# Altium project sensor.PrjPcb
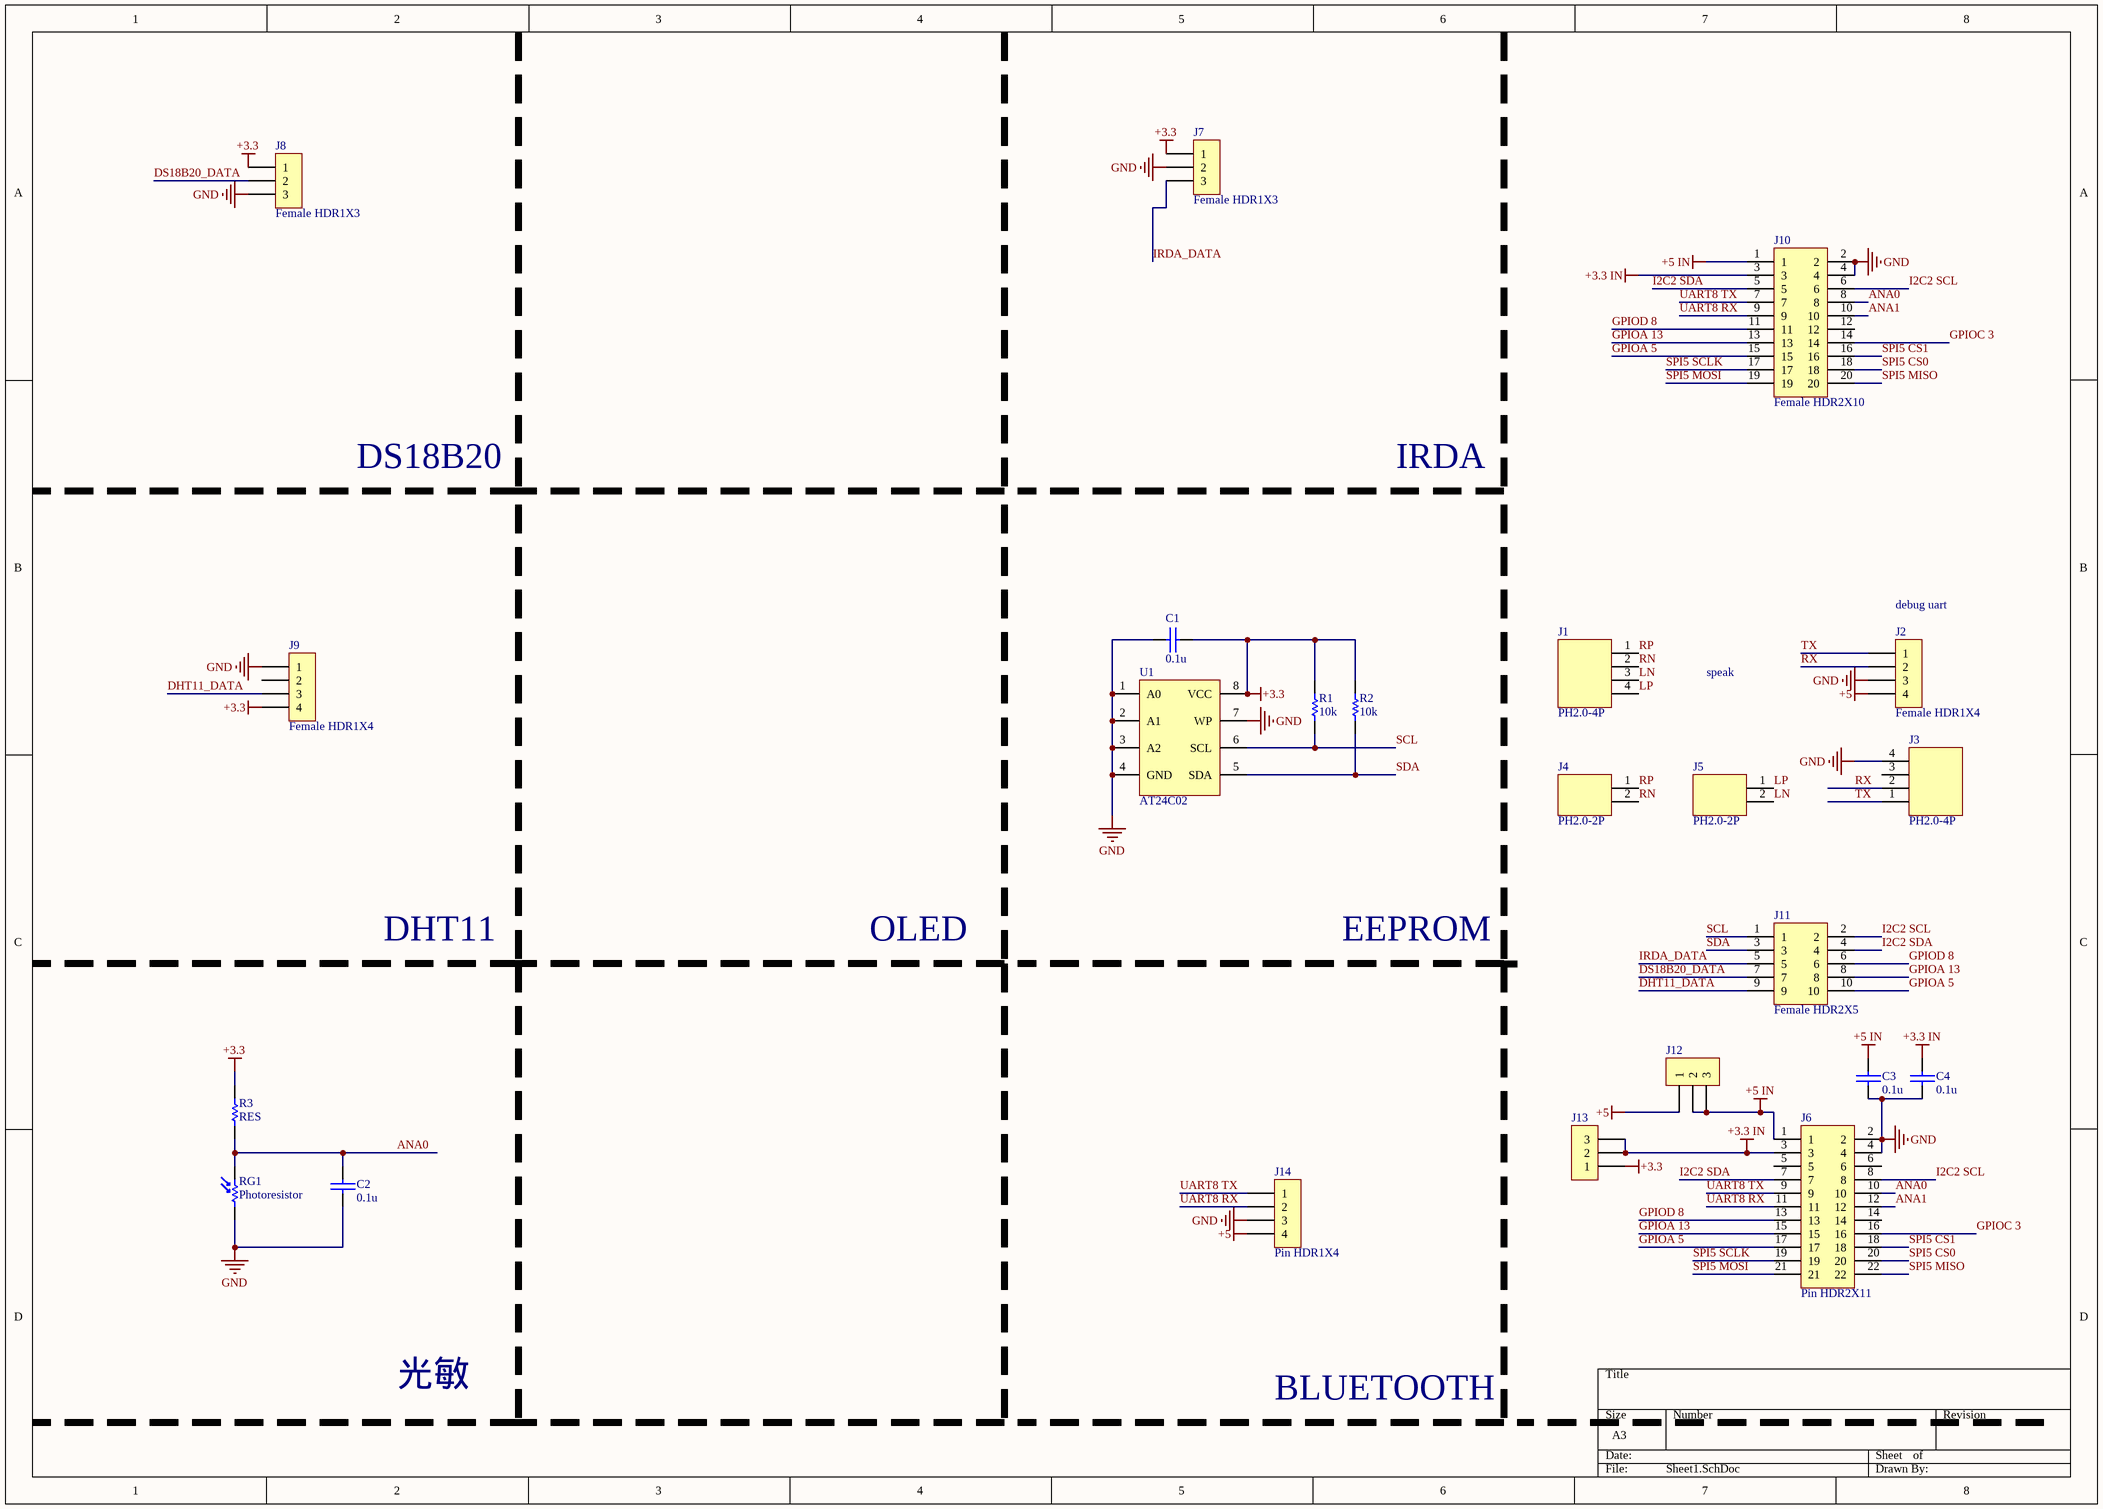
[diagram p0: Sheet1.SchDoc]
1 sheet, 23 parts. Net scope: global (net labels, ports and power ports of the same name join across sheets).
Board file: PCB1.PcbDoc

## Sheet Sheet1.SchDoc
size A3; SheetNumber: 1; SheetTotal: 1

### Parts
C1  0.1u  [0805C]
C2  0.1u  [0805C]
C3  0.1u  [0805C]
C4  0.1u  [0805C]
J1  PH2.0-4P  [PH2.0-4P]
J2  Female HDR1X4  [Fe-HDR1X4/2.54-S]
J3  PH2.0-4P  [PH2.0-4P]
J4  PH2.0-2P  [PH2.0-2P]
J5  PH2.0-2P  [PH2.0-2P]
J6  Pin HDR2X11  [HDR-TH_22P-P2.00-V-F-R2-C11-S2.00]
J7  Female HDR1X3  [Fe-HDR1X3/2.54-S]
J8  Female HDR1X3  [Fe-HDR1X3/2.54-S]
J9  Female HDR1X4  [Fe-HDR1X4/2.54-S]
J10  Female HDR2X10  [Fe-HDR2X10/2.54-S]
J11  Female HDR2X5  [Fe-HDR2X5/2.54-S]
J12  Female HDR1X3  [Fe-HDR1X3/2.54-S]  (value not drawn)
J13  Female HDR1X3  [Fe-HDR1X3/2.54-S]  (value not drawn)
J14  Pin HDR1X4  [Pin HDR1X4/2.54mm-S]
R1  10k  [0805R]
R2  10k  [0805R]
R3  RES  [0805R]
RG1  Photoresistor  [Photoresistor]
U1  AT24C02  [SOP8]

### Nets
+3.3: C1.2 J7.1 J8.1 J9.4 J13.1 R1.2 R2.2 R3.2 U1.8(VCC)
+3.3 IN: C4.2 J6.3 J10.3 J13.2 J13.3
+5: J2.4 J12.1 J14.4
+5 IN: C3.2 J6.1 J10.1 J12.2 J12.3
GND: C1.1 C2.1 C3.1 C4.1 J2.3 J3.4 J6.2 J6.4 J7.2 J8.3 J9.1 J10.2 J10.4 J14.3 RG1.1 U1.1(A0) U1.2(A1) U1.3(A2) U1.4(GND) U1.7(WP)
ANA0: C2.2 J6.10 J10.8 R3.1 RG1.2
ANA1: J6.12 J10.10
DHT11_DATA: J9.3 J11.9
DS18B20_DATA: J8.2 J11.7
GPIOA 5: J6.17 J10.15 J11.10
GPIOA 13: J6.15 J10.13 J11.8
GPIOC 3: J6.16 J10.14
GPIOD 8: J6.13 J10.11 J11.6
I2C2 SCL: J6.8 J10.6 J11.2
I2C2 SDA: J6.7 J10.5 J11.4
IRDA_DATA: J7.3 J11.5
LN: J1.3 J5.2
LP: J1.4 J5.1
RN: J1.2 J4.2
RP: J1.1 J4.1
RX: J2.2 J3.2
SCL: J11.1 R1.1 U1.6(SCL)
SDA: J11.3 R2.1 U1.5(SDA)
SPI5 CS0: J6.20 J10.18
SPI5 CS1: J6.18 J10.16
SPI5 MISO: J6.22 J10.20
SPI5 MOSI: J6.21 J10.19
SPI5 SCLK: J6.19 J10.17
TX: J2.1 J3.1
UART8 RX: J6.11 J10.9 J14.2
UART8 TX: J6.9 J10.7 J14.1

Not connected (* = marked no-connect by the designer): J3 3; J6 5 6 14; J9 2; J10 12

### Notes on the sheet
- DS18B20
- IRDA
- (near J2) debug uart
- speak
- DHT11
- OLED
- EEPROM
- 光敏
- BLUETOOTH

### Library data of the parts
C1-C4 = CAP: 无极性电容
R1 R2 = RES
RG1 = Photoresistor: 光敏电阻